# Altium schematic sheet Sheet1.SCHDOC
size 593 x 439 mm; ApprovedBy: ГрибановСВ; CheckedBy: КычкинАВ; Author: СергеевДС; DocumentNumber: ЕМС.02.00.100 Э3; SheetNumber: 1; SheetTotal: 4; DocumentName: Sheet1.SCHDOC
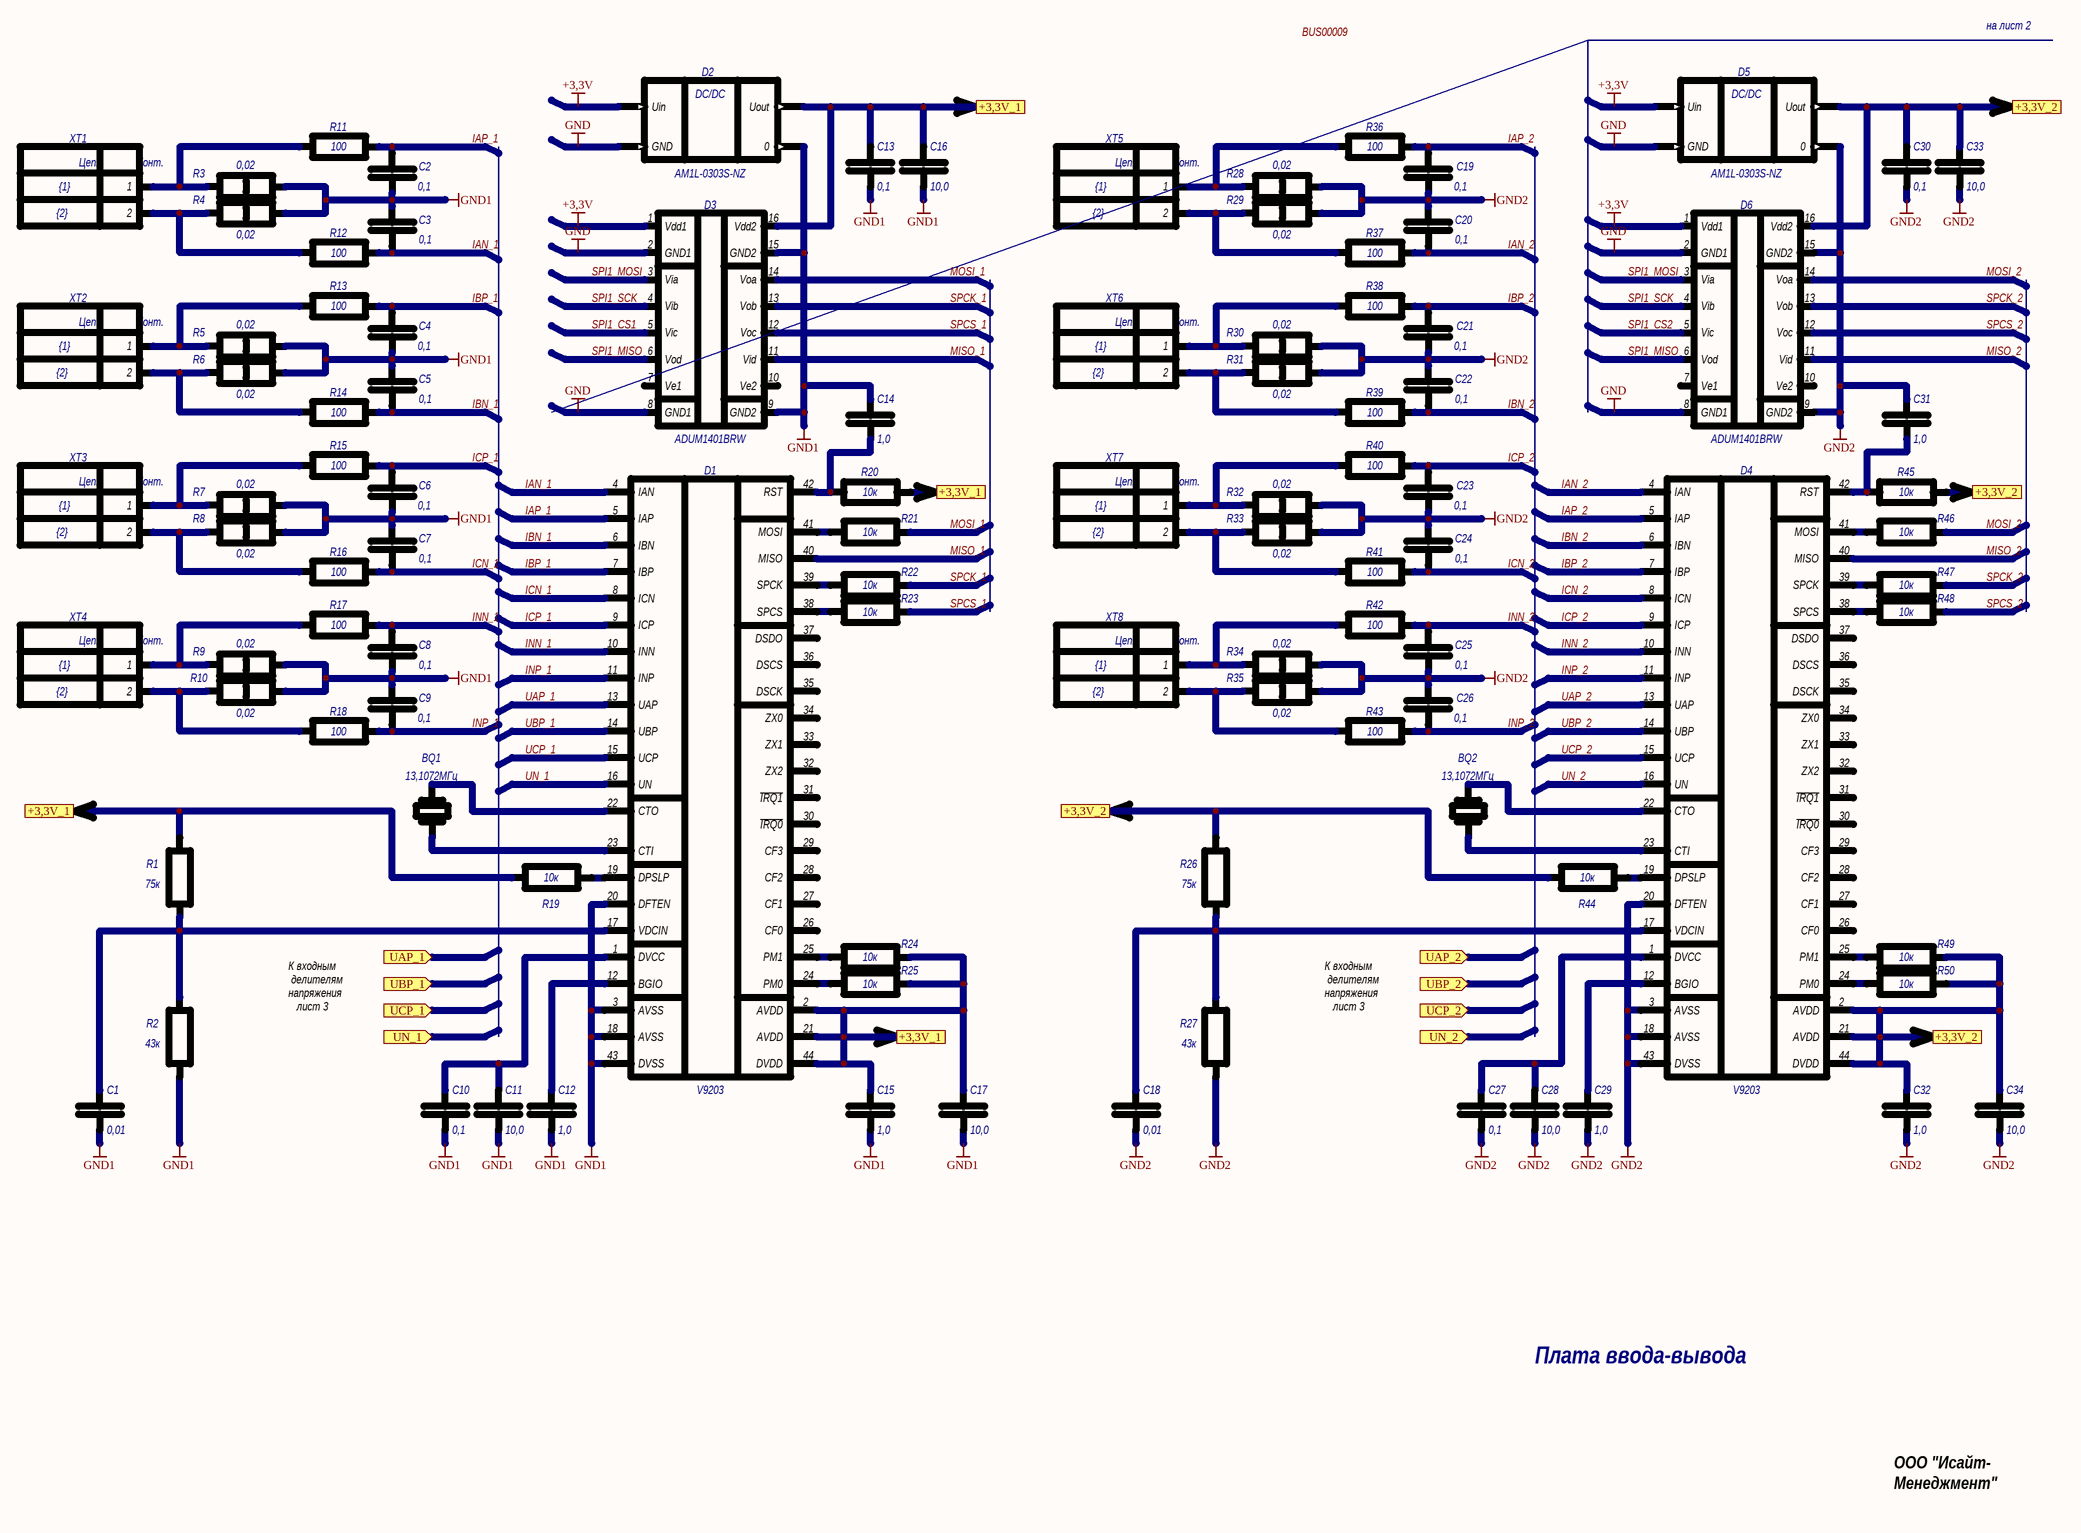
[diagram p0: Sheet1.SCHDOC]

## Parts
BQ1  HC49U-12M  [HC49U]  (value not drawn)
BQ2  HC49U-12M  [HC49U]  (value not drawn)
C1  value 0,01  [0805]  (hidden comment: К0805)
C2  value 0,1  [0805]  (hidden comment: К0805)
C3  value 0,1  [0805]  (hidden comment: К0805)
C4  value 0,1  [0805]  (hidden comment: К0805)
C5  value 0,1  [0805]  (hidden comment: К0805)
C6  value 0,1  [0805]  (hidden comment: К0805)
C7  value 0,1  [0805]  (hidden comment: К0805)
C8  value 0,1  [0805]  (hidden comment: К0805)
C9  value 0,1  [0805]  (hidden comment: К0805)
C10  value 0,1  [0805]  (hidden comment: К0805)
C11  value 10,0  [0805]  (hidden comment: К0805)
C12  value 1,0  [0805]  (hidden comment: К0805)
C13  value 0,1  [0805]  (hidden comment: К0805)
C14  value 1,0  [0805]  (hidden comment: К0805)
C15  value 1,0  [0805]  (hidden comment: К0805)
C16  value 10,0  [0805]  (hidden comment: К0805)
C17  value 10,0  [0805]  (hidden comment: К0805)
C18  value 0,01  [0805]  (hidden comment: К0805)
C19  value 0,1  [0805]  (hidden comment: К0805)
C20  value 0,1  [0805]  (hidden comment: К0805)
C21  value 0,1  [0805]  (hidden comment: К0805)
C22  value 0,1  [0805]  (hidden comment: К0805)
C23  value 0,1  [0805]  (hidden comment: К0805)
C24  value 0,1  [0805]  (hidden comment: К0805)
C25  value 0,1  [0805]  (hidden comment: К0805)
C26  value 0,1  [0805]  (hidden comment: К0805)
C27  value 0,1  [0805]  (hidden comment: К0805)
C28  value 10,0  [0805]  (hidden comment: К0805)
C29  value 1,0  [0805]  (hidden comment: К0805)
C30  value 0,1  [0805]  (hidden comment: К0805)
C31  value 1,0  [0805]  (hidden comment: К0805)
C32  value 1,0  [0805]  (hidden comment: К0805)
C33  value 10,0  [0805]  (hidden comment: К0805)
C34  value 10,0  [0805]  (hidden comment: К0805)
D1  V9203  [TQFP-44]
D2  value AM1L-0303S-NZ  [SIP-4]  (hidden comment: TME0505S)
D3  ADUM1401BRW  [SOL-16]
D4  V9203  [TQFP-44]
D5  value AM1L-0303S-NZ  [SIP-4]  (hidden comment: TME0505S)
D6  ADUM1401BRW  [SOL-16]
R1  Р0805  [0805]  (value not drawn)
R2  Р0805  [0805]  (value not drawn)
R3  value 0,02  [2512]  (hidden comment: Р2512)
R4  value 0,02  [2512]  (hidden comment: Р2512)
R5  value 0,02  [2512]  (hidden comment: Р2512)
R6  value 0,02  [2512]  (hidden comment: Р2512)
R7  value 0,02  [2512]  (hidden comment: Р2512)
R8  value 0,02  [2512]  (hidden comment: Р2512)
R9  value 0,02  [2512]  (hidden comment: Р2512)
R10  value 0,02  [2512]  (hidden comment: Р2512)
R11  value 100  [0805]  (hidden comment: Р0805)
R12  value 100  [0805]  (hidden comment: Р0805)
R13  value 100  [0805]  (hidden comment: Р0805)
R14  value 100  [0805]  (hidden comment: Р0805)
R15  value 100  [0805]  (hidden comment: Р0805)
R16  value 100  [0805]  (hidden comment: Р0805)
R17  value 100  [0805]  (hidden comment: Р0805)
R18  value 100  [0805]  (hidden comment: Р0805)
R19  Р0805  [0805]  (value not drawn)
R20  Р0805  [0805]  (value not drawn)
R21  Р0805  [0805]  (value not drawn)
R22  Р0805  [0805]  (value not drawn)
R23  Р0805  [0805]  (value not drawn)
R24  Р0805  [0805]  (value not drawn)
R25  Р0805  [0805]  (value not drawn)
R26  Р0805  [0805]  (value not drawn)
R27  Р0805  [0805]  (value not drawn)
R28  value 0,02  [2512]  (hidden comment: Р2512)
R29  value 0,02  [2512]  (hidden comment: Р2512)
R30  value 0,02  [2512]  (hidden comment: Р2512)
R31  value 0,02  [2512]  (hidden comment: Р2512)
R32  value 0,02  [2512]  (hidden comment: Р2512)
R33  value 0,02  [2512]  (hidden comment: Р2512)
R34  value 0,02  [2512]  (hidden comment: Р2512)
R35  value 0,02  [2512]  (hidden comment: Р2512)
R36  value 100  [0805]  (hidden comment: Р0805)
R37  value 100  [0805]  (hidden comment: Р0805)
R38  value 100  [0805]  (hidden comment: Р0805)
R39  value 100  [0805]  (hidden comment: Р0805)
R40  value 100  [0805]  (hidden comment: Р0805)
R41  value 100  [0805]  (hidden comment: Р0805)
R42  value 100  [0805]  (hidden comment: Р0805)
R43  value 100  [0805]  (hidden comment: Р0805)
R44  Р0805  [0805]  (value not drawn)
R45  Р0805  [0805]  (value not drawn)
R46  Р0805  [0805]  (value not drawn)
R47  Р0805  [0805]  (value not drawn)
R48  Р0805  [0805]  (value not drawn)
R49  Р0805  [0805]  (value not drawn)
R50  Р0805  [0805]  (value not drawn)
XT1  2: {2}  1: {1}  [EK508V-02P]  (hidden comment: EK508V-02P)
XT2  2: {2}  1: {1}  [EK508V-02P]  (hidden comment: EK508V-02P)
XT3  2: {2}  1: {1}  [EK508V-02P]  (hidden comment: EK508V-02P)
XT4  2: {2}  1: {1}  [EK508V-02P]  (hidden comment: EK508V-02P)
XT5  2: {2}  1: {1}  [EK508V-02P]  (hidden comment: EK508V-02P)
XT6  2: {2}  1: {1}  [EK508V-02P]  (hidden comment: EK508V-02P)
XT7  2: {2}  1: {1}  [EK508V-02P]  (hidden comment: EK508V-02P)
XT8  2: {2}  1: {1}  [EK508V-02P]  (hidden comment: EK508V-02P)

## Ports
+3,3V_1, +3,3V_2, UAP_1 (in), UAP_2 (in), UBP_1 (in), UBP_2 (in), UCP_1 (in), UCP_2 (in), UN_1 (in), UN_2 (in)

## Nets
+3,3V: D2.2(Uin) D3.1(Vdd1) D5.2(Uin) D6.1(Vdd1)
GND: D2.1(GND) D3.2(GND1) D3.8(GND1) D5.1(GND) D6.2(GND1) D6.8(GND1)
GND1: C1.1 C2.2 C3.2 C4.2 C5.2 C6.2 C7.2 C8.1 C9.1 C10.1 C11.1 C12.1 C13.1 C14.2 C15.1 C16.1 C17.1 D1.3(AVSS) D1.18(AVSS) D1.20(DFTEN) D1.43(DVSS) D2.3(0) D3.9(GND2) D3.15(GND2) R2.1 R3.2 R4.2 R5.2 R6.2 R7.2 R8.2 R9.2 R10.2
GND2: C18.1 C19.2 C20.2 C21.2 C22.2 C23.2 C24.2 C25.1 C26.1 C27.1 C28.1 C29.1 C30.1 C31.2 C32.1 C33.1 C34.1 D4.3(AVSS) D4.18(AVSS) D4.20(DFTEN) D4.43(DVSS) D5.3(0) D6.9(GND2) D6.15(GND2) R27.1 R28.2 R29.2 R30.2 R31.2 R32.2 R33.2 R34.2 R35.2
+3,3V_1: C13.2 C15.2 C16.2 C17.2 D1.2(AVDD) D1.21(AVDD) D1.44(DVDD) D2.4(Uout) D3.16(Vdd2) R1.2 R19.2 R20.2 R24.1 R25.1 ; port +3,3V_1
+3,3V_2: C30.2 C32.2 C33.2 C34.2 D4.2(AVDD) D4.21(AVDD) D4.44(DVDD) D5.4(Uout) D6.16(Vdd2) R26.2 R44.2 R45.2 R49.1 R50.1 ; port +3,3V_2
IAN_1: C3.1 D1.4(IAN) R12.1
IAN_2: C20.1 D4.4(IAN) R37.1
IAP_1: C2.1 D1.5(IAP) R11.1
IAP_2: C19.1 D4.5(IAP) R36.1
IBN_1: C5.1 D1.6(IBN) R14.1
IBN_2: C22.1 D4.6(IBN) R39.1
IBP_1: C4.1 D1.7(IBP) R13.1
IBP_2: C21.1 D4.7(IBP) R38.1
ICN_1: C7.1 D1.8(ICN) R16.1
ICN_2: C24.1 D4.8(ICN) R41.1
ICP_1: C6.1 D1.9(ICP) R15.1
ICP_2: C23.1 D4.9(ICP) R40.1
INN_1: C8.2 D1.10(INN) R17.1
INN_2: C25.2 D4.10(INN) R42.1
INP_1: C9.2 D1.11(INP) R18.1
INP_2: C26.2 D4.11(INP) R43.1
MISO_1: D1.40(MISO) D3.11(Vid)
MISO_2: D4.40(MISO) D6.11(Vid)
MOSI_1: D3.14(Voa) R21.1
MOSI_2: D6.14(Voa) R46.1
SPCK_1: D3.13(Vob) R22.1
SPCK_2: D6.13(Vob) R47.1
SPCS_1: D3.12(Voc) R23.1
SPCS_2: D6.12(Voc) R48.1
SPI1_CS1: D3.5(Vic)
SPI1_CS2: D6.5(Vic)
SPI1_MISO: D3.6(Vod) D6.6(Vod)
SPI1_MOSI: D3.3(Via) D6.3(Via)
SPI1_SCK: D3.4(Vib) D6.4(Vib)
UAP_1: D1.13(UAP)
UAP_2: D4.13(UAP)
UBP_1: D1.14(UBP)
UBP_2: D4.14(UBP)
UCP_1: D1.15(UCP)
UCP_2: D4.15(UCP)
UN_1: D1.16(UN)
UN_2: D4.16(UN)
NetBQ1_1: BQ1.1 D1.23(CTI)
NetBQ1_2: BQ1.2 D1.22(CTO)
NetBQ2_1: BQ2.1 D4.23(CTI)
NetBQ2_2: BQ2.2 D4.22(CTO)
NetC1_2: C1.2 D1.17(VDCIN) R1.1 R2.2
NetC10_2: C10.2 C11.2 D1.1(DVCC)
NetC12_2: C12.2 D1.12(BGIO)
NetC14_1: C14.1 D1.42(RST) R20.1
NetC18_2: C18.2 D4.17(VDCIN) R26.1 R27.2
NetC27_2: C27.2 C28.2 D4.1(DVCC)
NetC29_2: C29.2 D4.12(BGIO)
NetC31_1: C31.1 D4.42(RST) R45.1
NetD1_19: D1.19(DPSLP) R19.1
NetD1_24: D1.24(PM0) R25.2
NetD1_25: D1.25(PM1) R24.2
NetD1_38: D1.38(SPCS) R23.2
NetD1_39: D1.39(SPCK) R22.2
NetD1_41: D1.41(MOSI) R21.2
NetD4_19: D4.19(DPSLP) R44.1
NetD4_24: D4.24(PM0) R50.2
NetD4_25: D4.25(PM1) R49.2
NetD4_38: D4.38(SPCS) R48.2
NetD4_39: D4.39(SPCK) R47.2
NetD4_41: D4.41(MOSI) R46.2
NetR3_1: R3.1 R11.2 XT1.1
NetR4_1: R4.1 R12.2 XT1.2
NetR5_1: R5.1 R13.2 XT2.1
NetR6_1: R6.1 R14.2 XT2.2
NetR7_1: R7.1 R15.2 XT3.1
NetR8_1: R8.1 R16.2 XT3.2
NetR9_1: R9.1 R17.2 XT4.1
NetR10_1: R10.1 R18.2 XT4.2
NetR28_1: R28.1 R36.2 XT5.1
NetR29_1: R29.1 R37.2 XT5.2
NetR30_1: R30.1 R38.2 XT6.1
NetR31_1: R31.1 R39.2 XT6.2
NetR32_1: R32.1 R40.2 XT7.1
NetR33_1: R33.1 R41.2 XT7.2
NetR34_1: R34.1 R42.2 XT8.1
NetR35_1: R35.1 R43.2 XT8.2

Not connected (* = marked no-connect by the designer): D1 26(CF0) 27(CF1) 28(CF2) 29(CF3) 30(~{IRQ0}) 31(~{IRQ1}) 32(ZX2) 33(ZX1) 34(ZX0) 35(DSCK) 36(DSCS) 37(DSDO); D3 7(Ve1) 10(Ve2); D4 26(CF0) 27(CF1) 28(CF2) 29(CF3) 30(~{IRQ0}) 31(~{IRQ1}) 32(ZX2) 33(ZX1) 34(ZX0) 35(DSCK) 36(DSCS) 37(DSDO); D6 7(Ve1) 10(Ve2)

## Notes on the sheet
- на лист 2
- К входным
  делителям
  напряжения
  лист 3
- Плата ввода-вывода
- ООО "Исайт-
  Менеджмент"
- Labels drawn without touching a wire or pin: BUS00009
- Перв. примен.
- Справ. №
- Подп. и дата
- Инв. № дубл.
- Взам. инв. №
- Изм.
- Лист
- № докум.
- Подп.
- Дата
- Литера
- Масса
- Масштаб
- Пров.
- Разраб.
- О
- 1
- _
- Инв. № подл.
- Н.контр.
- Схема электрическая
  принципиальная
- Листов
- Утв.
- (in symbol EK508V-02P) Цепь; Конт.
- (in symbol HC49U-12M) 13,1072МГц
- (in symbol TME0505S) DC/DC
- (in symbol Р0805) 43к; 75к
- (in symbol Р0805_VARIANT_1) 10к

## Library data of the parts
BQ1 BQ2 = HC49U-12M: РЕЗОНАТОР; TG: {TG}; TO: 020, 211/-/12.0М; TU: {TU}; NO: 0524; RefDes2: {RefDes2}; ComponentHeight: {ComponentHeight}
C1-C34 = К0805: КОНДЕНСАТОР; TG: NP0; TO: 5%; TU: {TU}; NO: {NO}; RefDes2: {RefDes2}; ComponentHeight: 1
D1 D4 = V9203: {Description}; TG: {TG}; NO: {NO}; RefDes2: {RefDes2}; TU: {TU}; TO: {TO}; ComponentHeight: {ComponentHeight}
D2 D5 = TME0505S: МИКРОСХЕМА; TO: 320/SIP-4/SZ; TU: TRACO, AIMTEC; NO: 0007; RefDes2: {RefDes2}; ComponentHeight: 10
R1 R2 R26 R27 = Р0805: РЕЗИСТОР; TG: 0,125; TO: 1%; TU: {TU}; NO: {NO}; RefDes2: {RefDes2}; ComponentHeight: 1
R3-R10 R28-R35 = Р2512: РЕЗИСТОР; TG: 1; TO: 5%; TU: {TU}; NO: {NO}; RefDes2: {RefDes2}; ComponentHeight: 1.2
R11-R25 R36-R50 = Р0805_VARIANT_1: РЕЗИСТОР; TG: 0,125; TO: 1%; TU: {TU}; NO: {NO}; RefDes2: {RefDes2}; ComponentHeight: 1
XT1-XT8 = EK508V-02P: {Description}; Value: 5.08; TU: {TU}; TG: {TG}; RefDes2: {RefDes2}; TO: {TO}; NO: {NO}; N1: {N1}; N2: {N2}; ComponentHeight: {ComponentHeight}